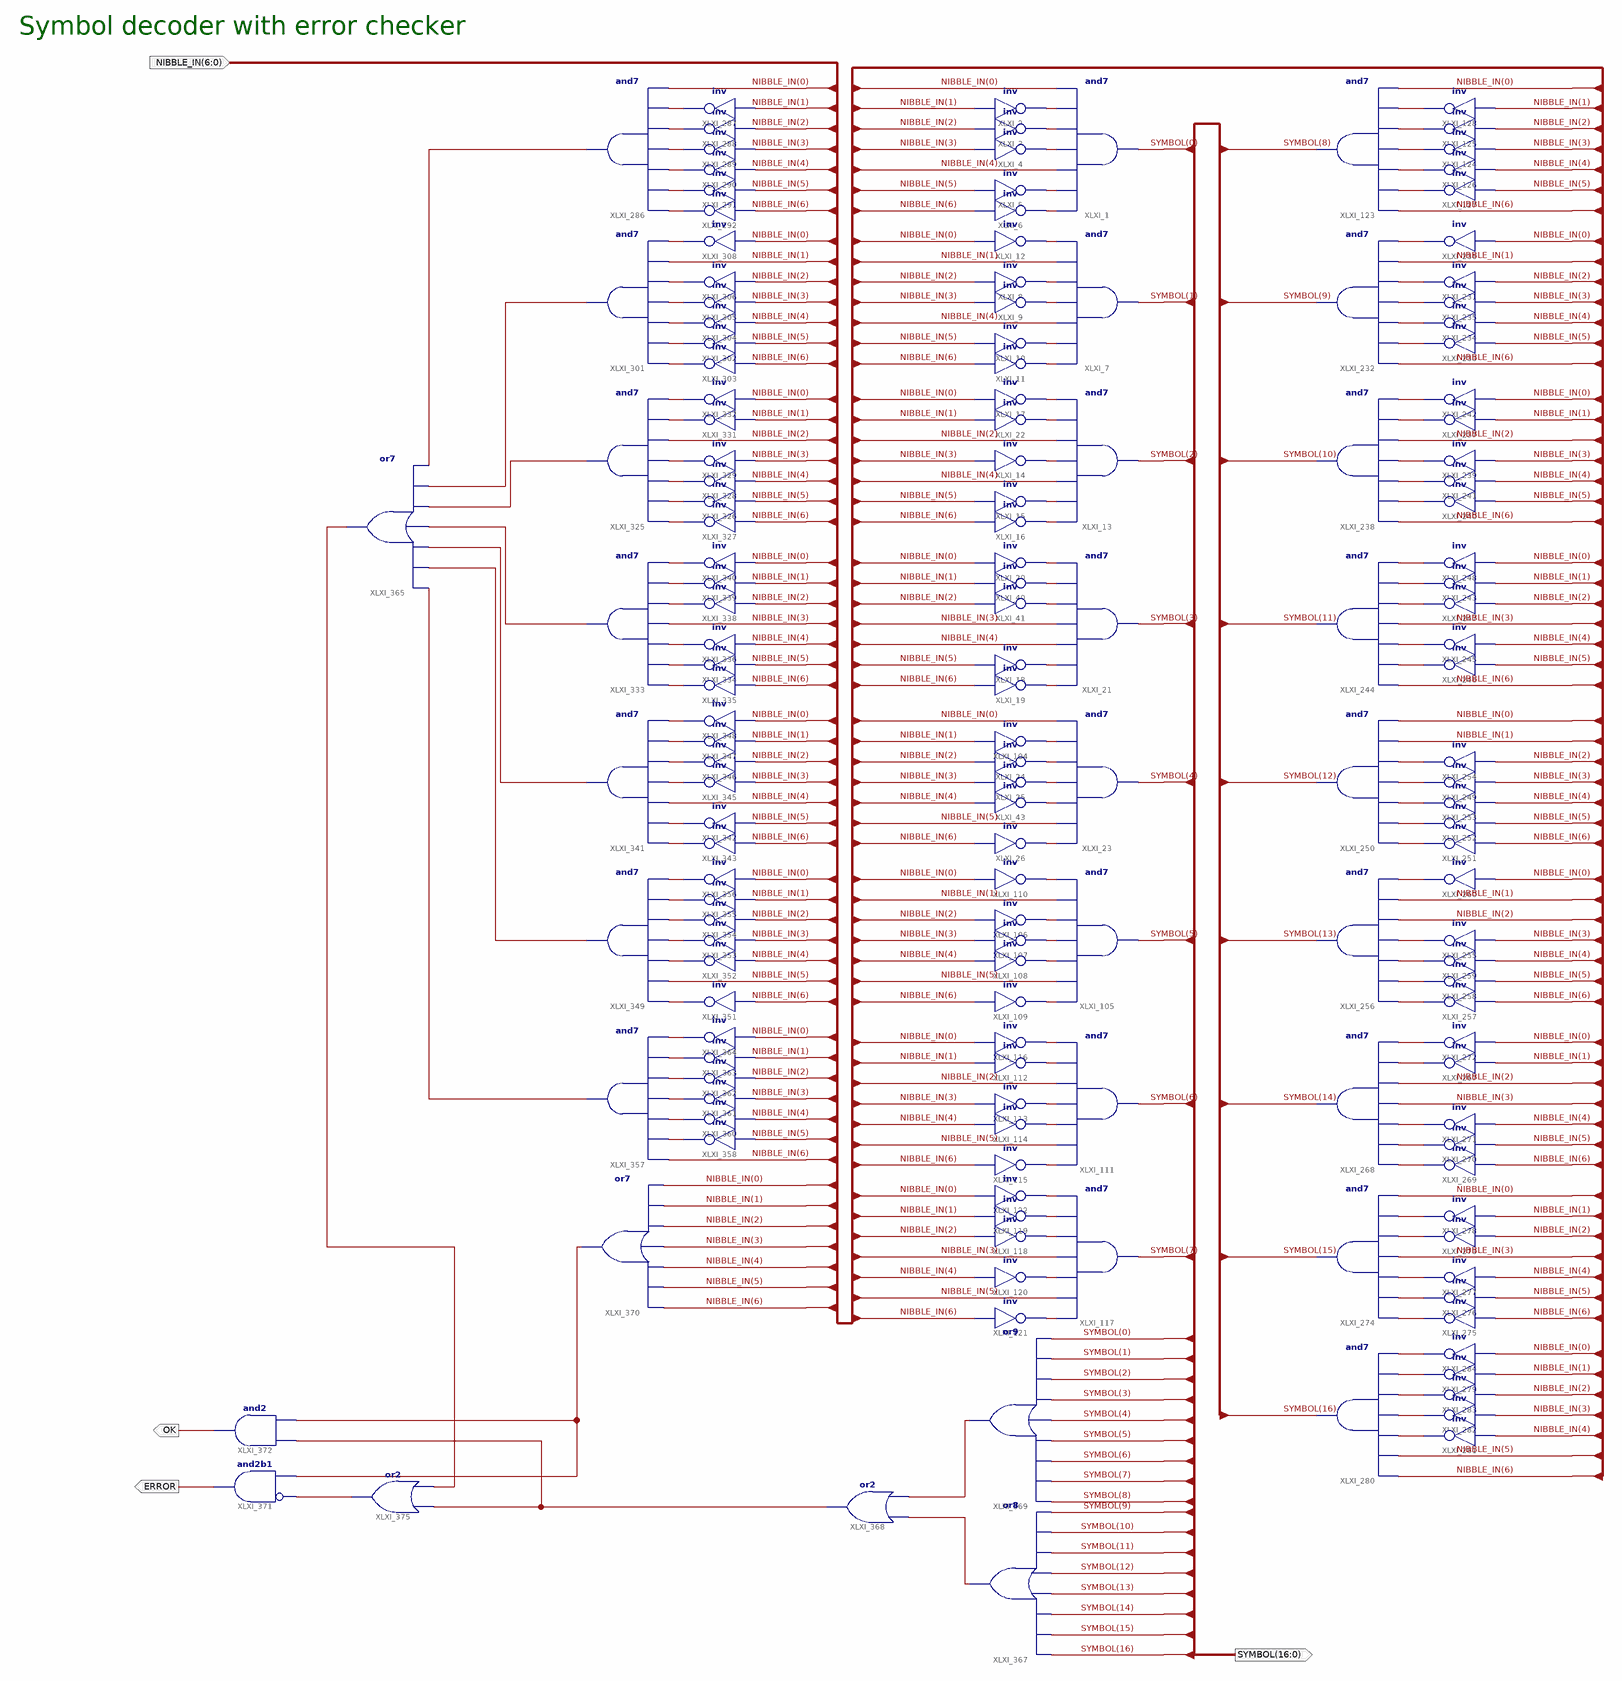
[diagram p0: schematic sheet 1]
// Xilinx ISE schematic Symbol_decoder.sch (xbr) as structural Verilog: 159 symbols, 4 ports
module Symbol_decoder (
  input  [6:0] NIBBLE_IN,
  output [16:0] SYMBOL,
  output OK,
  output ERROR
);

  wire XLXN_1, XLXN_2, XLXN_3, XLXN_4, XLXN_5, XLXN_8, XLXN_10, XLXN_11, XLXN_13, XLXN_14, XLXN_32, XLXN_33,
       XLXN_34, XLXN_35, XLXN_36, XLXN_44, XLXN_45, XLXN_46, XLXN_47, XLXN_48, XLXN_56, XLXN_57, XLXN_58,
       XLXN_59, XLXN_60, XLXN_68, XLXN_69, XLXN_70, XLXN_71, XLXN_72, XLXN_80, XLXN_81, XLXN_82, XLXN_83,
       XLXN_84, XLXN_92, XLXN_93, XLXN_94, XLXN_95, XLXN_96, XLXN_104, XLXN_228, XLXN_229, XLXN_230,
       XLXN_231, XLXN_239, XLXN_240, XLXN_241, XLXN_242, XLXN_243, XLXN_251, XLXN_252, XLXN_253, XLXN_254,
       XLXN_255, XLXN_263, XLXN_264, XLXN_266, XLXN_267, XLXN_268, XLXN_292, XLXN_293, XLXN_294, XLXN_295,
       XLXN_296, XLXN_304, XLXN_305, XLXN_306, XLXN_307, XLXN_308, XLXN_309, XLXN_318, XLXN_319, XLXN_320,
       XLXN_321, XLXN_329, XLXN_330, XLXN_331, XLXN_332, XLXN_333, XLXN_341, XLXN_342, XLXN_343, XLXN_344,
       XLXN_345, XLXN_350, XLXN_351, XLXN_352, XLXN_353, XLXN_354, XLXN_355, XLXN_363, XLXN_365, XLXN_366,
       XLXN_367, XLXN_368, XLXN_369, XLXN_384, XLXN_385, XLXN_387, XLXN_388, XLXN_389, XLXN_390, XLXN_391,
       XLXN_392, XLXN_393, XLXN_395, XLXN_396, XLXN_397, XLXN_398, XLXN_399, XLXN_400, XLXN_401, XLXN_403,
       XLXN_404, XLXN_405, XLXN_406, XLXN_407, XLXN_408, XLXN_409, XLXN_411, XLXN_412, XLXN_413, XLXN_414,
       XLXN_415, XLXN_416, XLXN_417, XLXN_419, XLXN_420, XLXN_421, XLXN_422, XLXN_423, XLXN_424, XLXN_425,
       XLXN_475, XLXN_476, XLXN_477, XLXN_519, XLXN_520, XLXN_521;

  and XLXI_1 (SYMBOL[0], XLXN_1, XLXN_2, NIBBLE_IN[4], XLXN_3, XLXN_4, XLXN_5, NIBBLE_IN[0]);
  not XLXI_2 (XLXN_5, NIBBLE_IN[1]);
  not XLXI_3 (XLXN_4, NIBBLE_IN[2]);
  not XLXI_4 (XLXN_3, NIBBLE_IN[3]);
  not XLXI_5 (XLXN_2, NIBBLE_IN[5]);
  not XLXI_6 (XLXN_1, NIBBLE_IN[6]);
  and XLXI_7 (SYMBOL[1], XLXN_14, XLXN_13, NIBBLE_IN[4], XLXN_11, XLXN_10, NIBBLE_IN[1], XLXN_8);
  not XLXI_8 (XLXN_10, NIBBLE_IN[2]);
  not XLXI_9 (XLXN_11, NIBBLE_IN[3]);
  not XLXI_10 (XLXN_13, NIBBLE_IN[5]);
  not XLXI_11 (XLXN_14, NIBBLE_IN[6]);
  not XLXI_12 (XLXN_8, NIBBLE_IN[0]);
  and XLXI_13 (SYMBOL[2], XLXN_36, XLXN_35, NIBBLE_IN[4], XLXN_34, NIBBLE_IN[2], XLXN_33, XLXN_32);
  not XLXI_14 (XLXN_34, NIBBLE_IN[3]);
  not XLXI_15 (XLXN_35, NIBBLE_IN[5]);
  not XLXI_16 (XLXN_36, NIBBLE_IN[6]);
  not XLXI_17 (XLXN_32, NIBBLE_IN[0]);
  not XLXI_18 (XLXN_47, NIBBLE_IN[5]);
  not XLXI_19 (XLXN_48, NIBBLE_IN[6]);
  not XLXI_20 (XLXN_44, NIBBLE_IN[0]);
  and XLXI_21 (SYMBOL[3], XLXN_48, XLXN_47, NIBBLE_IN[4], NIBBLE_IN[3], XLXN_46, XLXN_45, XLXN_44);
  not XLXI_22 (XLXN_33, NIBBLE_IN[1]);
  and XLXI_23 (SYMBOL[4], XLXN_60, NIBBLE_IN[5], XLXN_59, XLXN_58, XLXN_57, XLXN_56, NIBBLE_IN[0]);
  not XLXI_24 (XLXN_57, NIBBLE_IN[2]);
  not XLXI_25 (XLXN_58, NIBBLE_IN[3]);
  not XLXI_26 (XLXN_60, NIBBLE_IN[6]);
  and XLXI_105 (SYMBOL[5], XLXN_72, NIBBLE_IN[5], XLXN_71, XLXN_70, XLXN_69, NIBBLE_IN[1], XLXN_68);
  not XLXI_106 (XLXN_69, NIBBLE_IN[2]);
  not XLXI_107 (XLXN_70, NIBBLE_IN[3]);
  not XLXI_109 (XLXN_72, NIBBLE_IN[6]);
  not XLXI_110 (XLXN_68, NIBBLE_IN[0]);
  and XLXI_111 (SYMBOL[6], XLXN_84, NIBBLE_IN[5], XLXN_83, XLXN_82, NIBBLE_IN[2], XLXN_81, XLXN_80);
  not XLXI_113 (XLXN_82, NIBBLE_IN[3]);
  not XLXI_115 (XLXN_84, NIBBLE_IN[6]);
  not XLXI_116 (XLXN_80, NIBBLE_IN[0]);
  and XLXI_117 (SYMBOL[7], XLXN_96, NIBBLE_IN[5], XLXN_95, NIBBLE_IN[3], XLXN_94, XLXN_93, XLXN_92);
  not XLXI_118 (XLXN_94, NIBBLE_IN[2]);
  not XLXI_121 (XLXN_96, NIBBLE_IN[6]);
  not XLXI_122 (XLXN_92, NIBBLE_IN[0]);
  not XLXI_40 (XLXN_45, NIBBLE_IN[1]);
  not XLXI_41 (XLXN_46, NIBBLE_IN[2]);
  not XLXI_104 (XLXN_56, NIBBLE_IN[1]);
  not XLXI_43 (XLXN_59, NIBBLE_IN[4]);
  not XLXI_108 (XLXN_71, NIBBLE_IN[4]);
  not XLXI_112 (XLXN_81, NIBBLE_IN[1]);
  not XLXI_114 (XLXN_83, NIBBLE_IN[4]);
  not XLXI_119 (XLXN_93, NIBBLE_IN[1]);
  not XLXI_120 (XLXN_95, NIBBLE_IN[4]);
  and XLXI_123 (SYMBOL[8], NIBBLE_IN[6], XLXN_231, XLXN_230, XLXN_229, XLXN_228, XLXN_104, NIBBLE_IN[0]);
  not XLXI_128 (XLXN_104, NIBBLE_IN[1]);
  not XLXI_125 (XLXN_228, NIBBLE_IN[2]);
  not XLXI_124 (XLXN_229, NIBBLE_IN[3]);
  not XLXI_126 (XLXN_230, NIBBLE_IN[4]);
  not XLXI_127 (XLXN_231, NIBBLE_IN[5]);
  and XLXI_232 (SYMBOL[9], NIBBLE_IN[6], XLXN_243, XLXN_242, XLXN_241, XLXN_240, NIBBLE_IN[1], XLXN_239);
  not XLXI_236 (XLXN_239, NIBBLE_IN[0]);
  and XLXI_238 (SYMBOL[10], NIBBLE_IN[6], XLXN_255, XLXN_254, XLXN_253, NIBBLE_IN[2], XLXN_252, XLXN_251);
  not XLXI_240 (XLXN_255, NIBBLE_IN[5]);
  not XLXI_241 (XLXN_254, NIBBLE_IN[4]);
  not XLXI_242 (XLXN_251, NIBBLE_IN[0]);
  and XLXI_244 (SYMBOL[11], NIBBLE_IN[6], XLXN_268, XLXN_267, NIBBLE_IN[3], XLXN_266, XLXN_264, XLXN_263);
  not XLXI_246 (XLXN_268, NIBBLE_IN[5]);
  not XLXI_248 (XLXN_263, NIBBLE_IN[0]);
  not XLXI_231 (XLXN_240, NIBBLE_IN[2]);
  not XLXI_235 (XLXN_241, NIBBLE_IN[3]);
  not XLXI_234 (XLXN_242, NIBBLE_IN[4]);
  not XLXI_233 (XLXN_243, NIBBLE_IN[5]);
  not XLXI_237 (XLXN_252, NIBBLE_IN[1]);
  not XLXI_239 (XLXN_253, NIBBLE_IN[3]);
  not XLXI_243 (XLXN_264, NIBBLE_IN[1]);
  not XLXI_247 (XLXN_266, NIBBLE_IN[2]);
  not XLXI_245 (XLXN_267, NIBBLE_IN[4]);
  and XLXI_250 (SYMBOL[12], XLXN_296, XLXN_295, XLXN_294, XLXN_293, XLXN_292, NIBBLE_IN[1], NIBBLE_IN[0]);
  not XLXI_251 (XLXN_296, NIBBLE_IN[6]);
  not XLXI_252 (XLXN_295, NIBBLE_IN[5]);
  not XLXI_253 (XLXN_294, NIBBLE_IN[4]);
  and XLXI_256 (SYMBOL[13], XLXN_309, XLXN_308, XLXN_307, XLXN_306, NIBBLE_IN[2], NIBBLE_IN[1], XLXN_305);
  not XLXI_257 (XLXN_309, NIBBLE_IN[6]);
  not XLXI_258 (XLXN_308, NIBBLE_IN[5]);
  not XLXI_259 (XLXN_307, NIBBLE_IN[4]);
  not XLXI_260 (XLXN_305, NIBBLE_IN[0]);
  and XLXI_268 (SYMBOL[14], XLXN_321, XLXN_320, XLXN_319, NIBBLE_IN[3], NIBBLE_IN[2], XLXN_318, XLXN_304);
  not XLXI_269 (XLXN_321, NIBBLE_IN[6]);
  not XLXI_270 (XLXN_320, NIBBLE_IN[5]);
  not XLXI_271 (XLXN_319, NIBBLE_IN[4]);
  not XLXI_272 (XLXN_304, NIBBLE_IN[0]);
  and XLXI_274 (SYMBOL[15], XLXN_345, XLXN_344, XLXN_343, NIBBLE_IN[3], XLXN_342, XLXN_341, NIBBLE_IN[0]);
  not XLXI_275 (XLXN_345, NIBBLE_IN[6]);
  not XLXI_276 (XLXN_344, NIBBLE_IN[5]);
  not XLXI_277 (XLXN_343, NIBBLE_IN[4]);
  not XLXI_249 (XLXN_293, NIBBLE_IN[3]);
  not XLXI_254 (XLXN_292, NIBBLE_IN[2]);
  not XLXI_255 (XLXN_306, NIBBLE_IN[3]);
  and XLXI_280 (SYMBOL[16], NIBBLE_IN[6], NIBBLE_IN[5], XLXN_333, XLXN_332, XLXN_331, XLXN_330, XLXN_329);
  not XLXI_267 (XLXN_318, NIBBLE_IN[1]);
  not XLXI_284 (XLXN_329, NIBBLE_IN[0]);
  not XLXI_279 (XLXN_330, NIBBLE_IN[1]);
  not XLXI_283 (XLXN_331, NIBBLE_IN[2]);
  not XLXI_282 (XLXN_332, NIBBLE_IN[3]);
  not XLXI_281 (XLXN_333, NIBBLE_IN[4]);
  not XLXI_278 (XLXN_341, NIBBLE_IN[1]);
  not XLXI_273 (XLXN_342, NIBBLE_IN[2]);
  and XLXI_286 (XLXN_419, NIBBLE_IN[0], XLXN_350, XLXN_351, XLXN_352, XLXN_353, XLXN_354, XLXN_355);
  not XLXI_291 (XLXN_354, NIBBLE_IN[5]);
  not XLXI_292 (XLXN_355, NIBBLE_IN[6]);
  not XLXI_290 (XLXN_353, NIBBLE_IN[4]);
  not XLXI_289 (XLXN_352, NIBBLE_IN[3]);
  not XLXI_288 (XLXN_351, NIBBLE_IN[2]);
  not XLXI_287 (XLXN_350, NIBBLE_IN[1]);
  and XLXI_301 (XLXN_420, XLXN_363, NIBBLE_IN[1], XLXN_365, XLXN_366, XLXN_367, XLXN_368, XLXN_369);
  not XLXI_302 (XLXN_368, NIBBLE_IN[5]);
  not XLXI_303 (XLXN_369, NIBBLE_IN[6]);
  not XLXI_304 (XLXN_367, NIBBLE_IN[4]);
  not XLXI_305 (XLXN_366, NIBBLE_IN[3]);
  not XLXI_306 (XLXN_365, NIBBLE_IN[2]);
  not XLXI_308 (XLXN_363, NIBBLE_IN[0]);
  and XLXI_325 (XLXN_421, XLXN_384, XLXN_385, NIBBLE_IN[2], XLXN_387, XLXN_388, XLXN_389, XLXN_390);
  not XLXI_326 (XLXN_389, NIBBLE_IN[5]);
  not XLXI_327 (XLXN_390, NIBBLE_IN[6]);
  not XLXI_328 (XLXN_388, NIBBLE_IN[4]);
  not XLXI_329 (XLXN_387, NIBBLE_IN[3]);
  not XLXI_331 (XLXN_385, NIBBLE_IN[1]);
  not XLXI_332 (XLXN_384, NIBBLE_IN[0]);
  and XLXI_333 (XLXN_422, XLXN_391, XLXN_392, XLXN_393, NIBBLE_IN[3], XLXN_395, XLXN_396, XLXN_397);
  not XLXI_334 (XLXN_396, NIBBLE_IN[5]);
  not XLXI_335 (XLXN_397, NIBBLE_IN[6]);
  not XLXI_336 (XLXN_395, NIBBLE_IN[4]);
  not XLXI_338 (XLXN_393, NIBBLE_IN[2]);
  not XLXI_339 (XLXN_392, NIBBLE_IN[1]);
  not XLXI_340 (XLXN_391, NIBBLE_IN[0]);
  and XLXI_341 (XLXN_423, XLXN_398, XLXN_399, XLXN_400, XLXN_401, NIBBLE_IN[4], XLXN_403, XLXN_404);
  not XLXI_342 (XLXN_403, NIBBLE_IN[5]);
  not XLXI_343 (XLXN_404, NIBBLE_IN[6]);
  not XLXI_345 (XLXN_401, NIBBLE_IN[3]);
  not XLXI_346 (XLXN_400, NIBBLE_IN[2]);
  not XLXI_347 (XLXN_399, NIBBLE_IN[1]);
  not XLXI_348 (XLXN_398, NIBBLE_IN[0]);
  and XLXI_349 (XLXN_424, XLXN_405, XLXN_406, XLXN_407, XLXN_408, XLXN_409, NIBBLE_IN[5], XLXN_411);
  not XLXI_351 (XLXN_411, NIBBLE_IN[6]);
  not XLXI_352 (XLXN_409, NIBBLE_IN[4]);
  not XLXI_353 (XLXN_408, NIBBLE_IN[3]);
  not XLXI_354 (XLXN_407, NIBBLE_IN[2]);
  not XLXI_355 (XLXN_406, NIBBLE_IN[1]);
  not XLXI_356 (XLXN_405, NIBBLE_IN[0]);
  and XLXI_357 (XLXN_425, XLXN_412, XLXN_413, XLXN_414, XLXN_415, XLXN_416, XLXN_417, NIBBLE_IN[6]);
  not XLXI_358 (XLXN_417, NIBBLE_IN[5]);
  not XLXI_360 (XLXN_416, NIBBLE_IN[4]);
  not XLXI_361 (XLXN_415, NIBBLE_IN[3]);
  not XLXI_362 (XLXN_414, NIBBLE_IN[2]);
  not XLXI_363 (XLXN_413, NIBBLE_IN[1]);
  not XLXI_364 (XLXN_412, NIBBLE_IN[0]);
  or XLXI_365 (XLXN_475, XLXN_419, XLXN_420, XLXN_421, XLXN_422, XLXN_423, XLXN_424, XLXN_425);
  or XLXI_367 (XLXN_477, SYMBOL[9], SYMBOL[10], SYMBOL[11], SYMBOL[12], SYMBOL[13], SYMBOL[14], SYMBOL[15], SYMBOL[16]);
  or XLXI_369 (XLXN_476, SYMBOL[0], SYMBOL[1], SYMBOL[2], SYMBOL[3], SYMBOL[4], SYMBOL[5], SYMBOL[6], SYMBOL[7], SYMBOL[8]);
  or XLXI_370 (XLXN_521, NIBBLE_IN[0], NIBBLE_IN[1], NIBBLE_IN[2], NIBBLE_IN[3], NIBBLE_IN[4], NIBBLE_IN[5], NIBBLE_IN[6]);
  or XLXI_375 (XLXN_520, XLXN_475, XLXN_519);
  and XLXI_371 (ERROR, ~XLXN_520, XLXN_521);  // and2b1
  and XLXI_372 (OK, XLXN_521, XLXN_519);
  or XLXI_368 (XLXN_519, XLXN_476, XLXN_477);

  // Notes on the sheet:
  //   Symbol decoder with error checker
endmodule
